# Altium schematic sheet PWR_5to3.3_RT9193.SchDoc
size A4
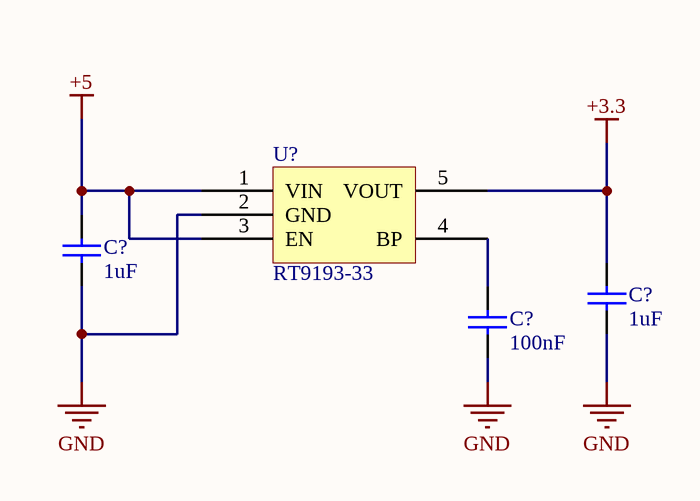
[diagram p0: PWR_5to3.3_RT9193.SchDoc]

## Parts
(Parts that share a designator on the sheet are numbered #1, #2 ... from top to bottom, then left to right.)
C?#1  value 1uF  [0603]  (hidden comment: Cap)
C?#2  value 1uF  [0603]  (hidden comment: Cap)
C?#3  value 100nF  [0603]  (hidden comment: Cap)
U?  RT9193-33  [SOT23-5 RT9193-33]

## Nets
+3.3: C?#2.2 U?.5(VOUT)
+5: C?#1.2 U?.1(VIN) U?.3(EN)
GND: C?#1.1 C?#2.1 C?#3.1 U?.2(GND)
NetC?#3_2: C?#3.2 U?.4(BP)

## Library data of the parts
C?#1-C?#3 = Cap: 无极性电容; Published: 8-Jun-2000; LatestRevisionDate: 17-Jul-2002; LatestRevisionNote: Re-released for DXP Platform.; PackageReference: RAD-0.3; Publisher: Altium Limited